# EAGLE design mp3412-boost-driver-17mm-mk-2.0 (EAGLE 6.6.0)
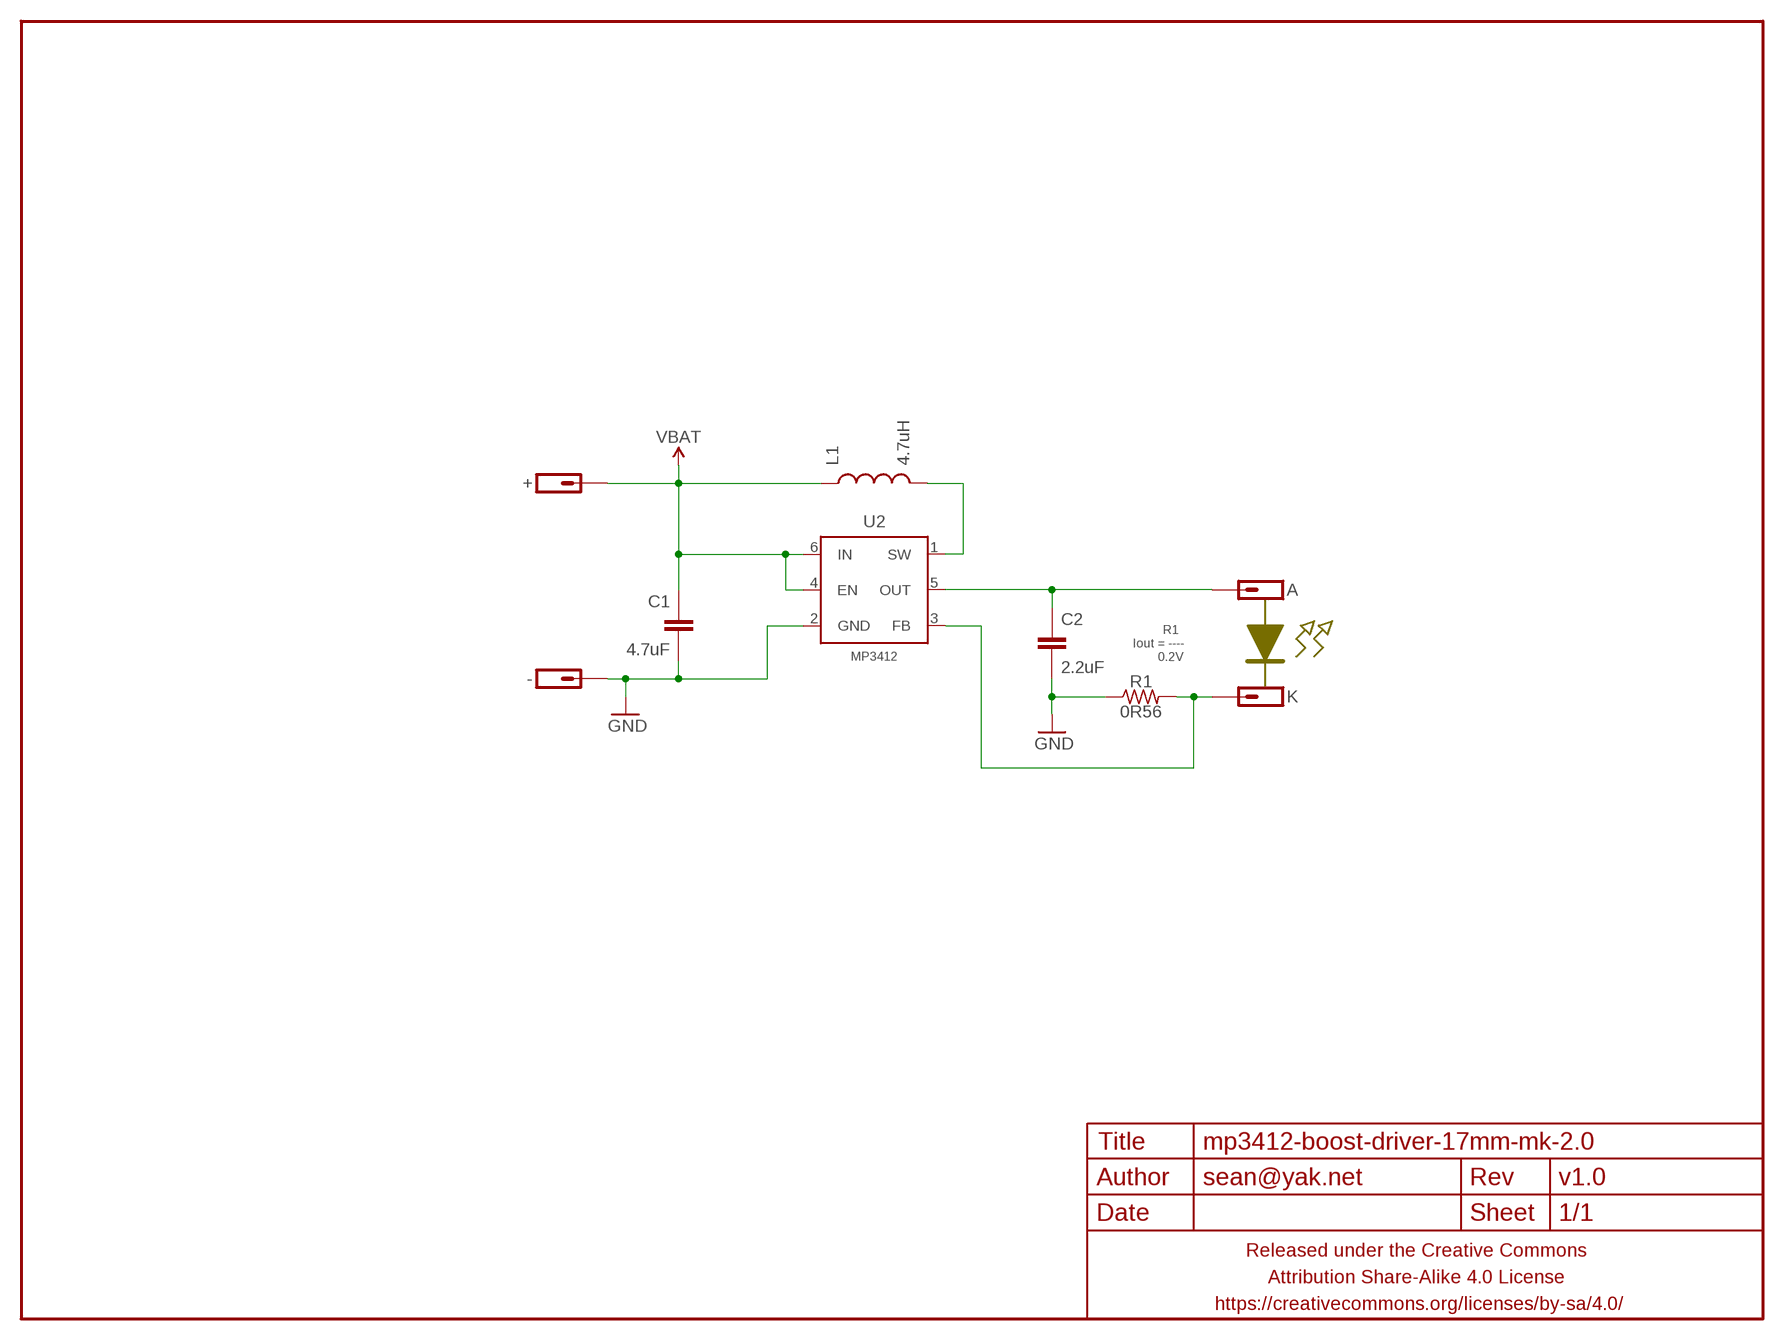
[diagram p0: schematic, sheet 1]

## Parts
+  M01NOT-A-VIA-NOPE  [1X01_NOSILK_NOSTOP]
-  M01NOT-A-VIA-NOPE  [1X01_NOSILK_NOSTOP]
A  M01PTH-1MM-CIR-NS  [1X01-1MM-CIR-NS]
C1  4.7uF  CAPACITOR-CERAMICC0603-TIGHTER  [C0603-TIGHTER]
C2  2.2uF  CAPACITOR-CERAMICC0603-TIGHTER  [C0603-TIGHTER]
FRAME1  FRAME-LETTERNO_PACKAGE  [DUMMY]
K  M01PTH-1MM-CIR-NS  [1X01-1MM-CIR-NS]
L1  4.7uH  INDUCTORXFL4020  [XFL4020]
R1  0R56  RESISTORR0603-TIGHTER  [R0603-TIGHTER]
U2  MP3412  [TSOT-23-6]

## Nets
GND: -.P$1 C1.2 C2.2 R1.1 U2.2(GND)
N$2: A.1 C2.1 U2.5(OUT)
N$3: K.1 R1.2 U2.3(FB)
SW: L1.P$2 U2.1(SW)
VBAT: +.P$1 C1.1 L1.P$1 U2.4(EN) U2.6(IN)

## Notes on the sheet
- R1
  Iout = ----
         0.2V

## Library data of the parts
+ - A K = a_parts:M01: Header 1 Standard 1-pin 0.1" header. Use with straight break away headers (SKU : PRT-00116), right angle break away headers (PRT-00553), swiss pins (PRT-00743), machine pins (PRT-00117), and female headers (PRT-00115).
C1 C2 = a_parts:CAPACITOR-CERAMIC: CAPACITOR, European symbol
FRAME1 = a_parts:FRAME-LETTER: Schematic Frame Standard 8.5x11 US Letter frame; DESIGNER: sean@yak.net; VERSION: v1.0
L1 = a_parts:INDUCTOR: Inductors Basic Inductor/Choke - 0603 and 1206. Footprints are not proven and vary greatly between part numbers. SRN6045- 33uH, 20% 1.4A SDR0403-560KL - 56uH, 10%, 500mA RMS/740mA peak
R1 = a_parts:RESISTOR: RESISTOR, American symbol
U2 = a_parts:MP3412

## Board
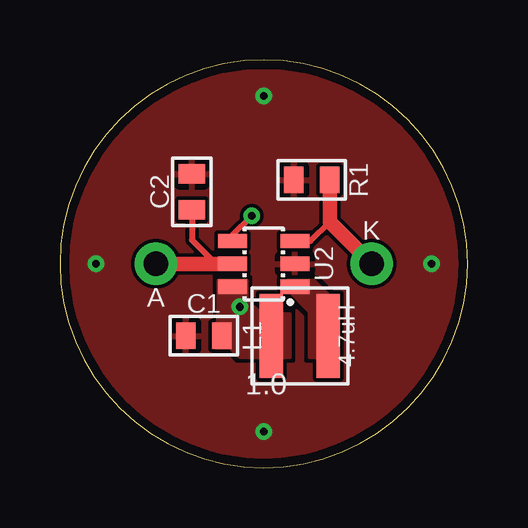
[diagram p1: board, top side]
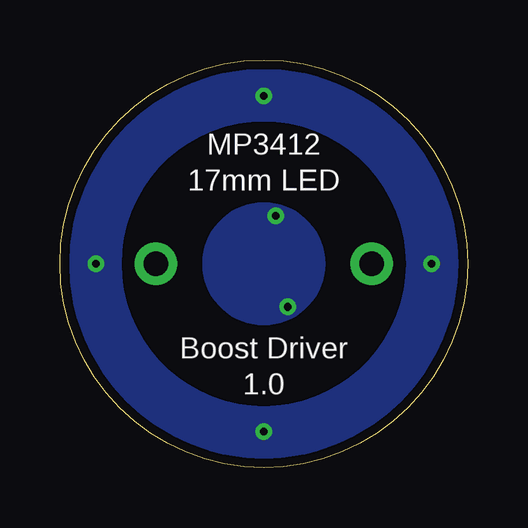
[diagram p2: board, bottom side, seen from below]

Size 17 x 17 mm. Coordinates in mm from the lower left corner, seen from the top.
Outline: 0,8.5 arc180 17,8.5 arc180 0,8.5
Copper layers (1*16): Top 0.0356mm / dielectric 1.5011mm / Bottom 0.0356mm
Design rules "LaenPCBOrder2": minimum track width 6mil, minimum drill 13mil, track to track 6mil, track to pad 6mil, pad to pad 6mil, via to via 6mil, smd to smd 6mil, copper to edge 15mil, drill to drill 6mil, minimum pad ring 7mil, minimum via ring 7mil, stop-mask expansion 3mil, vias tented up to drill 20mil, thermal gap 10mil

### Footprints (pad centres in the part's own frame; a part is rotated, then mirrored left to right if it is on the bottom)
1X01_NOSILK_NOSTOP = drill 0.33: P$1 0,0
1X01-1MM-CIR-NS = drill 1.016 pad 1.778: 1 0,0
C0603-TIGHTER = smd 0.8 x 1.1: 1 -0.75,0; 2 0.75,0
XFL4020 = smd 0.98 x 3.5: P$1 -1.185,0; P$2 1.185,0
R0603-TIGHTER = smd 0.8 x 1.1: 1 -0.75,0; 2 0.75,0
TSOT-23-6 = smd 0.6 x 1.2: 1 -0.95,-1.3; 2 0,-1.3; 3 0.95,-1.3; 4 0.95,1.3; 5 0,1.3; 6 -0.95,1.3

### Placement (x,y rotation side)
+  7.5,6.7 0 bottom
-  8.5,15.5 90 bottom
A  4,8.5 180 top
C1  6,5.5 180 top
C2  5.5,11.5 90 top
FRAME1  0,0 0 top
K  13,8.5 0 top
L1  10,5.5 0 top
R1  10.5,12 0 top
U2  8.5,8.5 90 top

### Tracks (layer width: path | path; a pad name or v marks a point on that pad's centre or on a via)
GND  (via drill 0.33)
  other vias: 1.5,8.5 15.5,8.5 8.5,1.5
  pour Top (isolate 0.152, rank 6): 0,0 0,17 17,17 17,0
  pour Bottom (isolate 0.152, no thermals): 0,8.5 2.5,8.5 arc-90 8.5,14.5 arc-90 14.5,8.5 17,8.5 17,17 0,17
  pour Bottom (isolate 0.152, no thermals): 17,8.5 14.5,8.5 arc-90 8.5,2.5 arc-90 2.5,8.5 0,8.5 0,0 17,0
N$2
  Top 0.25: C2.1 5.5,9.5 6.5,8.5
  Top 0.6: A.1 6.5,8.5 U2.5
N$3
  Top 0.25: U2.3 10.45,9.45 11.25,10.25
  Top 0.6: R1.2 11.25,10.25 K.1
SW
  pour Top (isolate 0.152, no thermals): 9.5,7.8 9.5,7.4 10.4,6.5 10.4,4.6 11.5,4.6 11.5,6.9 10.6,7.8
VBAT  (via drill 0.33)
  Top 0.25: U2.4 7.2,9.7 v8,10.5
  pour Bottom (isolate 0.152, no thermals): 8.5,6 arc-90 6,8.5 arc-90 8.5,11 arc-90 11,8.5 arc-90
  pour Top (isolate 0.152, no thermals): 6.5,5 6.5,6 6.6,6.1 6.6,7.8 7.8,7.8 7.8,7 8.4,6.4 9.6,6.4 9.6,4.6 7.5,4.6 7.1,5

### Text on the board
bPlace: MP3412 | 17mm LED | Boost Driver